# EAGLE design afig-adaptor (EAGLE 9.5.1)
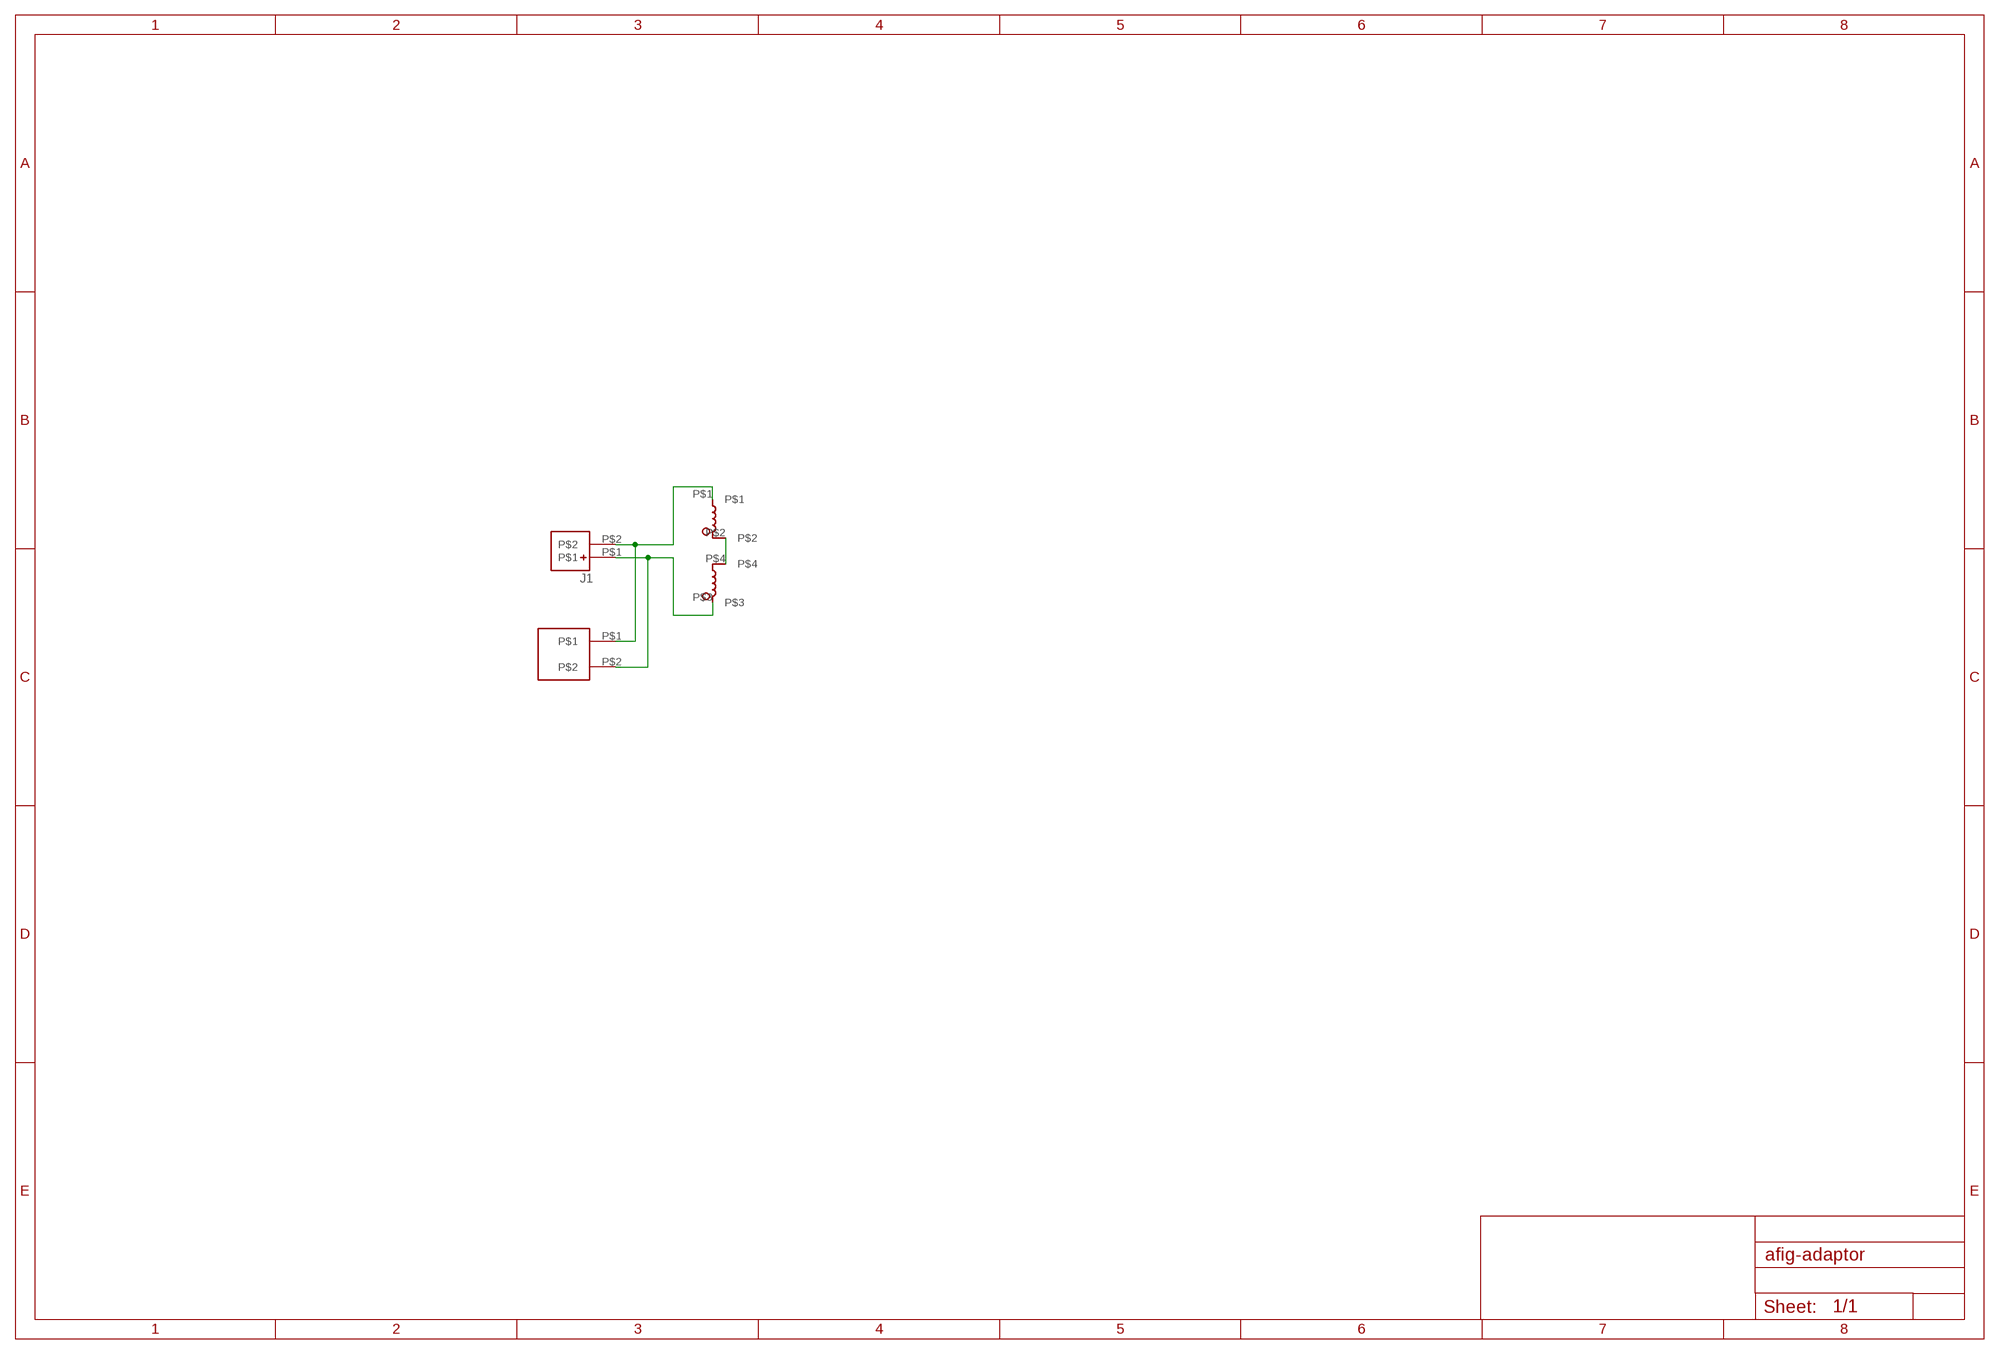
[diagram p0: schematic, sheet 1]

## Parts
J1  B2B-PH-SM4-TB  [B2B-PH-SM4-TB]
U$1  AFIG-0007  [AFIG-0007]
U$2  0878580002  [0878580002]

## Nets
N$1: U$1.P$2 U$1.P$4
N$3: J1.P$1 U$1.P$3 U$2.P$2
N$4: J1.P$2 U$1.P$1 U$2.P$1

## Library data of the parts
J1 = JST-PH:B2B-PH-SM4-TB
U$1 = afig-0007:AFIG-0007
U$2 = afig-0007:0878580002

## Board
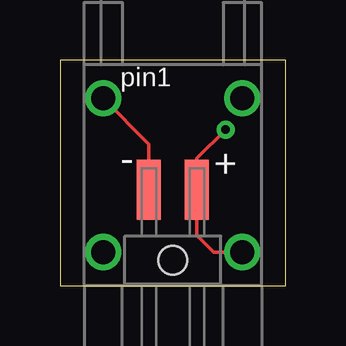
[diagram p1: board, top side]
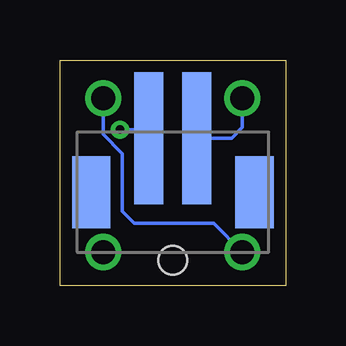
[diagram p2: board, bottom side, seen from below]

Size 9.4 x 9.4 mm. Coordinates in mm from the lower left corner, seen from the top.
Outline: 9.4,9.4 0,9.4 0,0 9.4,0 9.4,9.4
Copper layers (1*16): Top 0.035mm / dielectric 1.5mm / Bottom 0.035mm
Design rules "default *": minimum track width 6mil, minimum drill 0.35mm, track to track 6mil, track to pad 6mil, pad to pad 6mil, via to via 6mil, smd to smd 6mil, copper to edge 12mil, drill to drill 6mil, minimum pad ring 10mil, minimum via ring 8mil, stop-mask expansion 4mil, vias tented up to drill 0mil, thermal gap 10mil

### Footprints (pad centres in the part's own frame; a part is rotated, then mirrored left to right if it is on the bottom)
B2B-PH-SM4-TB = smd 1.2 x 5.5: P$1 -1,-1.05; P$2 1,-1.05 | smd 1.6 x 3: P$3 -3.4,1.2; P$4 3.4,1.2
AFIG-0007 = drill 1: P$1 -2.9,3.2; P$2 2.9,3.2; P$3 2.9,-3.2; P$4 -2.9,-3.2
0878580002 = smd 1 x 2.5: P$1 -1,0; P$2 1,0 | hole 1.2: 0,2.94

### Placement (x,y rotation side)
J1  4.7,5.1 180 bottom
U$1  4.7,4.6 180 top
U$2  4.7,4 180 top

### Tracks (layer width: path | path; a pad name or v marks a point on that pad's centre or on a via)
N$1
  Bottom 0.152: U$1.P$2 3,2.6 6.3,2.6 6.8,3.1 6.8,5.5 7.6,6.3 U$1.P$4
N$3
  Top 0.152: U$2.P$2 3.7,5.9 U$1.P$3
  Bottom 0.152: J1.P$1 2.25,6.15 1.8,6.6 U$1.P$3
N$4  (via drill 0.35)
  Top 0.152: U$1.P$1 6.4,1.4 5.7,2.1 U$2.P$1 5.7,5.3 v6.9,6.5
  Bottom 0.152: v6.9,6.5 5.9,6.5 5.8,6.6 5.7,6.5 J1.P$2

### Text on the board
tPlace: pin1 | - | +